# EAGLE design lcd_mounting_board (EAGLE 7.7.0)
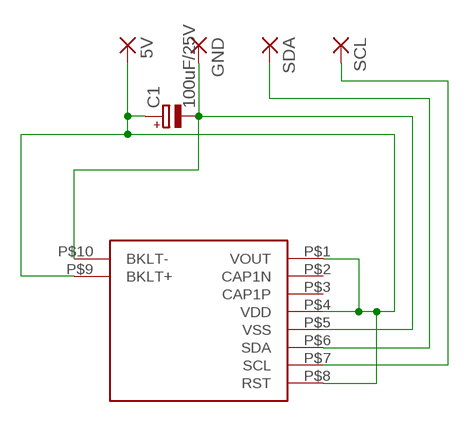
[diagram p0: schematic, sheet 1]

## Parts
5V  2,15/1,0  [2,15/1,0]
C1  100uF/25V  CPOL-EUE2.5-6  [E2,5-6]
GND  2,15/1,0  [2,15/1,0]
SCL  2,15/1,0  [2,15/1,0]
SDA  2,15/1,0  [2,15/1,0]
U$1  MCCOG22005A6W-BNMLWI  [MCCOG22005A6W-BNMLWI]

## Nets
5V: 5V.1(P) C1.+ U$1.P$1(VOUT) U$1.P$4(VDD) U$1.P$8(RST) U$1.P$9(BKLT+)
GND: C1.- GND.1(P) U$1.P$5(VSS) U$1.P$10(BKLT-)
SCL: SCL.1(P) U$1.P$7(SCL)
SDA: SDA.1(P) U$1.P$6(SDA)
Unconnected: U$1.P$2(CAP1N) U$1.P$3(CAP1P)

## Library data of the parts
5V GND SCL SDA = wirepad:2,15/1,0: THROUGH-HOLE PAD
C1 = rcl:CPOL-EU: POLARIZED CAPACITOR, European symbol
U$1 = 0000halfgaar:MCCOG22005A6W-BNMLWI: MIDAS MCCOG22005A6W-BNMLWI Farnell Order code: 2218944 Controller: ST7032i (very common I2c LCD controller)

## Board
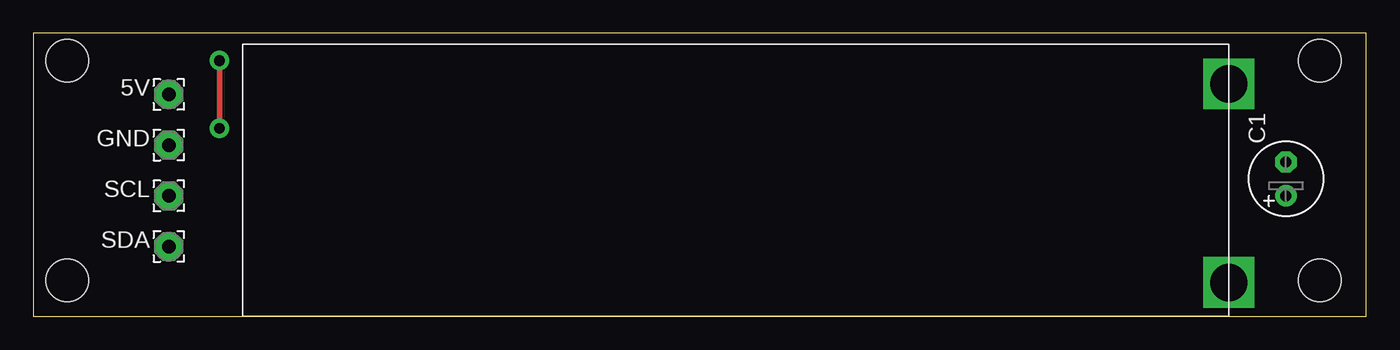
[diagram p1: board, top side]
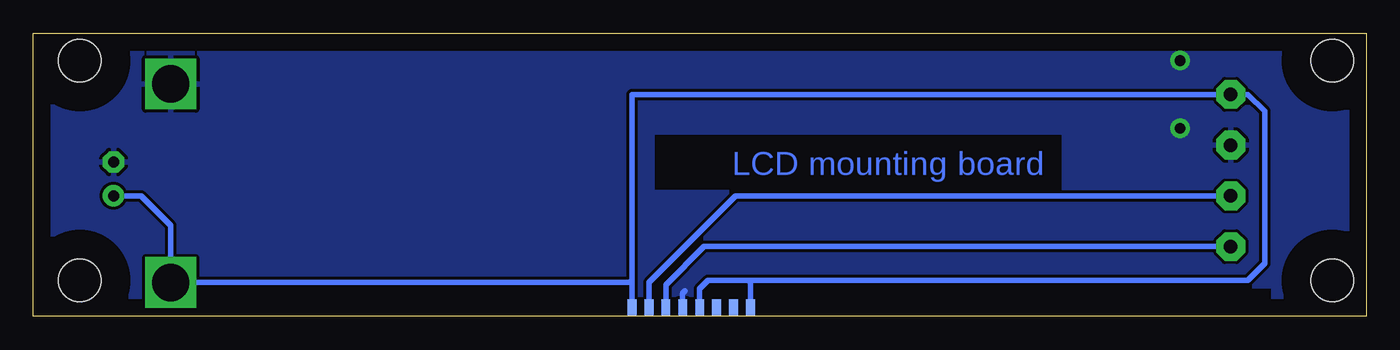
[diagram p2: board, bottom side, seen from below]

Size 100 x 21.26 mm. Coordinates in mm from the lower left corner, seen from the top.
Outline: 0,0 100,0 100,21.26 0,21.26 0,0
Copper layers (1*16): Top 0.035mm / dielectric 1.6mm / Bottom 0.035mm
Design rules "verysmall": minimum track width 10mil, minimum drill 31mil, track to track 9mil, track to pad 8mil, pad to pad 7mil, via to via 20mil, smd to smd 7mil, copper to edge 50mil, drill to drill 40mil, minimum pad ring 13mil, minimum via ring 13mil, stop-mask expansion 4mil, vias tented up to drill 0mil, thermal gap 10mil
Holes 3.2 mm at 2.54,19.21 2.54,2.7 96.52,2.7 96.52,19.21
bRestrict: area -1.1,15.6 to 6.1,22.8; area -1.1,-0.9 to 6.1,6.3; area 92.9,-0.9 to 100.1,6.3; area 92.9,15.6 to 100.1,22.8; area 22.9,9.5 to 53.3,13.6; area 7.1,0.5 to 45.4,2.1

### Footprints (pad centres in the part's own frame; a part is rotated, then mirrored left to right if it is on the bottom)
2,15/1,0 = drill 1.016 pad 2.159 octagon: 1 0,0
E2,5-6 = drill 0.813 pad 1.6: + -1.27,0 | drill 0.813 pad 1.6 octagon: - 1.27,0
MCCOG22005A6W-BNMLWI = smd 0.66 x 1.27 bottom: P$1 -7.938,-9.525; P$2 -6.668,-9.525; P$3 -5.397,-9.525; P$4 -4.128,-9.525; P$5 -2.857,-9.525; P$6 -1.587,-9.525; P$7 -0.318,-9.525; P$8 0.953,-9.525 | drill 2.8 square: P$9 35.56,-7.62; P$10 35.56,7.298

### Placement (x,y rotation side)
5V  10.16,16.67 0 top
C1  93.98,10.32 90 top
GND  10.16,12.86 0 top
SCL  10.16,9.05 0 top
SDA  10.16,5.24 0 top
U$1  54.13,10.16 0 top

### Tracks (layer width: path | path; a pad name or v marks a point on that pad's centre or on a via)
5V
  Bottom 0.406: U$1.P$8 55.09,2.7 | 55.09,2.7 55.09,16.67 5V.1 8.89,16.67 7.62,15.4 7.62,3.97 8.89,2.7 46.35,2.7 | U$1.P$4 50.01,2.06 49.37,2.7 46.35,2.7 | C1.+ 91.92,9.05 89.69,6.83 U$1.P$9 55.24,2.54 55.09,2.7 | U$1.P$1 46.2,2.54 46.35,2.7
GND  (via drill 0.8)
  Top 0.406: v13.97,14.13 v13.97,19.21
  Bottom 0.406: 51.12,1.91 51.28,1.75 U$1.P$5
  pour Bottom: 0,20.48 0,0 99.06,0 99.06,20.48
SCL
  Bottom 0.406: SCL.1 47.31,9.05 53.82,2.54 U$1.P$7
SDA
  Bottom 0.406: SDA.1 49.69,5.24 52.55,2.38 U$1.P$6

### Text on the board
Bottom: LCD mounting board